# EAGLE design trezor_nuri (EAGLE 9.6.2)
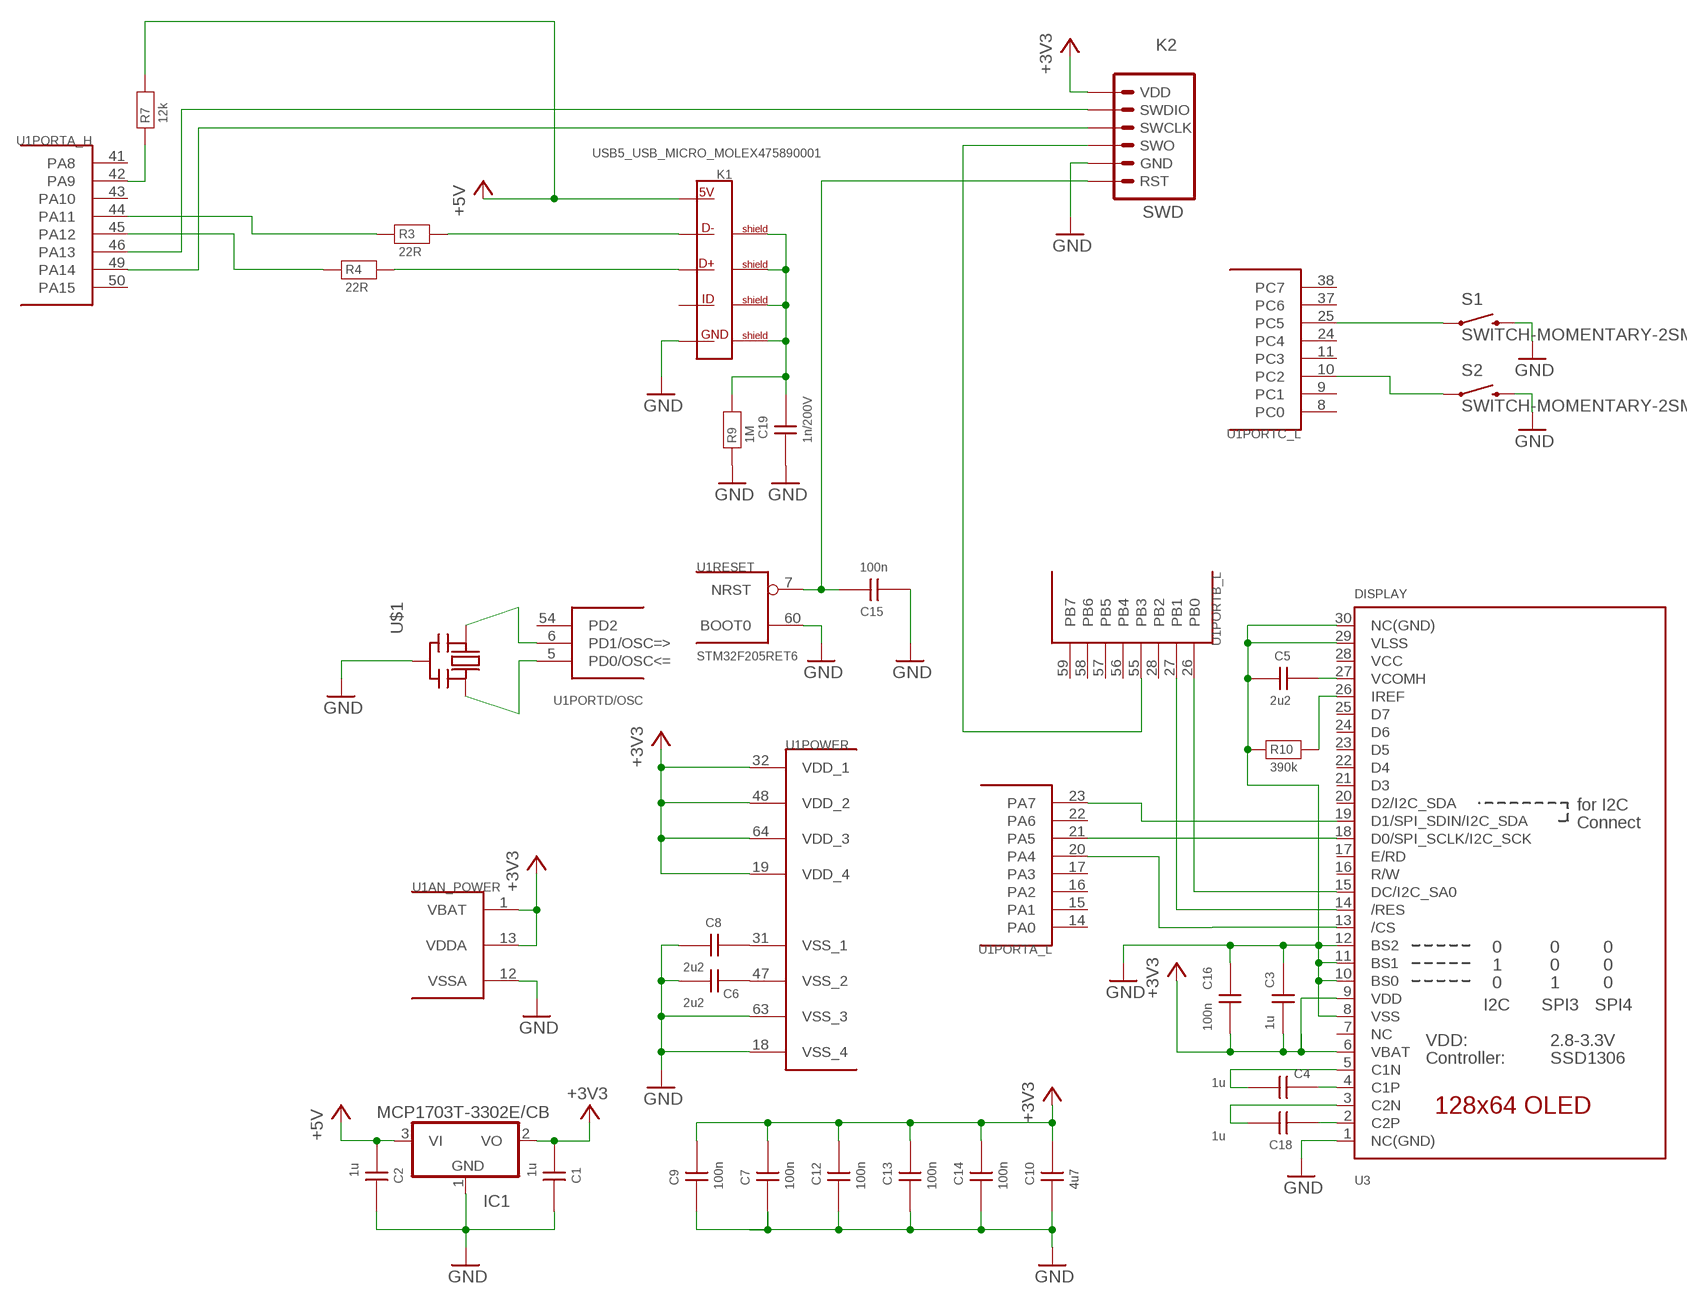
[diagram p0: schematic, sheet 1]

## Parts
C1  1u  C_0805  [0805]
C2  1u  C_0805  [0805]
C3  1u  C_0805  [0805]
C4  1u  C_0805  [0805]
C5  2u2  C_0805  [0805]
C6  2u2  C_0805  [0805]
C7  100n  C_0805  [0805]
C8  2u2  C_0805  [0805]
C9  100n  C_0805  [0805]
C10  4u7  C_0805  [0805]
C12  100n  C_0805  [0805]
C13  100n  C_0805  [0805]
C14  100n  C_0805  [0805]
C15  100n  C_0805  [0805]
C16  100n  C_0805  [0805]
C18  1u  C_0805  [0805]
C19  1n/200V  C_0805  [0805]
IC1  MCP1703T-3302E/CB  MCP1703CB  [SOT23]
K1  USB5_USB_MICRO_MOLEX475890001  [USB_MICRO-MOLEX475890001]
K2  SWD  [SWD]
R3  22R  R_0805  [0805]
R4  22R  R_0805  [0805]
R7  12k  R_0805  [0805]
R9  1M  R_0805  [0805]
R10  390k  R_0805  [0805]
S1  SWITCH-MOMENTARY-2SMD  [TACTILE_SWITCH_SMD]
S2  SWITCH-MOMENTARY-2SMD  [TACTILE_SWITCH_SMD]
U1  STM32F205RET6  STM32F10XRXT6  [TQFP64]
U3  DISPLAY  DISP_OLED_UG-2864HSWEG010.96"  [UG-2864HSWEG01_0.96IN_WRAPAROUND]
U$1  CERMOSCILL-CSTCRG  [CSTCR-G]

## Nets
+3V3: C1.1 C3.1 C7.2 C9.2 C10.2 C12.2 C13.2 C14.2 C16.1 IC1.2(VO) K2.6(VDD) U1.1(AN_POWER:VBAT) U1.13(AN_POWER:VDDA) U1.19(POWER:VDD_4) U1.32(POWER:VDD_1) U1.48(POWER:VDD_2) U1.64(POWER:VDD_3) U3.6(VBAT) U3.9(VDD)
+5V: C2.1 IC1.3(VI) K1.1(1_5V) R7.2
GND: C1.2 C2.2 C3.2 C5.1 C6.1 C7.1 C8.1 C9.1 C10.1 C12.1 C13.1 C14.1 C15.1 C16.2 C19.1 IC1.1(GND) K1.5(5_GND) K2.2(GND) R9.1 R10.1 S1.3 S1.4 S2.3 S2.4 U1.12(AN_POWER:VSSA) U1.18(POWER:VSS_4) U1.60(RESET:BOOT0) U1.63(POWER:VSS_3) U3.1(NC(GND)) U3.8(VSS) U3.10(BS0) U3.11(BS1) U3.12(BS2) U3.29(VLSS) U3.30(NC(GND)) U$1.2(GND)
N$1: U1.23(PORTA_L:PA7) U3.19(D1/SPI_SDIN/I2C_SDA)
N$2: C15.2 K2.1(RST) U1.7(RESET:NRST)
N$3: U1.26(PORTB_L:PB0) U3.15(DC/I2C_SA0)
N$4: C8.2 U1.31(POWER:VSS_1)
N$5: U1.21(PORTA_L:PA5) U3.18(D0/SPI_SCLK/I2C_SCK)
N$6: C5.2 U3.27(VCOMH)
N$7: U1.27(PORTB_L:PB1) U3.14(/RES)
N$8: C6.2 U1.47(POWER:VSS_2)
N$9: R10.2 U3.26(IREF)
N$10: C18.1 U3.2(C2P)
N$11: C4.1 U3.4(C1P)
N$12: C18.2 U3.3(C2N)
N$13: C4.2 U3.5(C1N)
N$14: K2.3(SWO) U1.55(PORTB_L:PB3)
N$15: K2.5(SWDIO) U1.46(PORTA_H:PA13)
N$16: U1.20(PORTA_L:PA4) U3.13(/CS)
N$17: K2.4(SWCLK) U1.49(PORTA_H:PA14)
N$18: R3.1 U1.44(PORTA_H:PA11)
N$19: S1.1 S1.2 U1.25(PORTC_L:PC5)
N$20: S2.1 S2.2 U1.10(PORTC_L:PC2)
N$23: K1.2(2_D-) R3.2
N$24: K1.3(3_D+) R4.2
N$26: C19.2 K1.S1_BOT(SHIELD_1) K1.S1_TOP(SHIELD_1) K1.S2_BOT(SHIELD_2) K1.S2_TOP(SHIELD_2) K1.S3_BOT(SHIELD_3) K1.S3_TOP(SHIELD_3) K1.S4_BOT(SHIELD_4) K1.S4_TOP(SHIELD_4) K1.SA(SHIELD_1) K1.SB(SHIELD_2) R9.2
N$27: R7.1 U1.42(PORTA_H:PA9)
USB_D_P: R4.1 U1.45(PORTA_H:PA12)
XTAL1: U1.6(PORTD/OSC:PD1/OSC=>) U$1.1(IN)
XTAL2: U1.5(PORTD/OSC:PD0/OSC<=) U$1.3(OUT)
Unconnected: K1.4(4_ID) U1.2(PORTC_H:PC13) U1.3(PORTC_H:PC14) U1.4(PORTC_H:PC15) U1.8(PORTC_L:PC0) U1.9(PORTC_L:PC1) U1.11(PORTC_L:PC3) U1.14(PORTA_L:PA0) U1.15(PORTA_L:PA1) U1.16(PORTA_L:PA2) U1.17(PORTA_L:PA3) U1.22(PORTA_L:PA6) U1.24(PORTC_L:PC4) U1.28(PORTB_L:PB2) U1.29(PORTB_H:PB10) U1.30(PORTB_H:PB11) U1.33(PORTB_H:PB12) U1.34(PORTB_H:PB13) U1.35(PORTB_H:PB14) U1.36(PORTB_H:PB15) U1.37(PORTC_L:PC6) U1.38(PORTC_L:PC7) U1.39(PORTC_H:PC8) U1.40(PORTC_H:PC9) U1.41(PORTA_H:PA8) U1.43(PORTA_H:PA10) U1.50(PORTA_H:PA15) U1.51(PORTC_H:PC10) U1.52(PORTC_H:PC11) U1.53(PORTC_H:PC12) U1.54(PORTD/OSC:PD2) U1.56(PORTB_L:PB4) U1.57(PORTB_L:PB5) U1.58(PORTB_L:PB6) U1.59(PORTB_L:PB7) U1.61(PORTB_H:PB8) U1.62(PORTB_H:PB9) U3.7(NC) U3.16(R/W) U3.17(E/RD) U3.20(D2/I2C_SDA) U3.21(D3) U3.22(D4) U3.23(D5) U3.24(D6) U3.25(D7)

## Power pins joined to a net without a drawn wire
VCC: U3.28(VCC)

## Library data of the parts
C1-C10 C12-C16 C18 C19 = vyber:C
IC1 = linear:MCP1703: 250 mA, 16V, Low Quiescent Current LDO Regulator Source: http://ww1.microchip.com/downloads/en/DeviceDoc/22049b.pdf
K1 = vyber:USB5
K2 = fabhack:SWD: SWD Miniature connector for ARM programming.
R3 R4 R7 R9 R10 = vyber:R
S1 S2 = SparkFun-Electromechanical:SWITCH-MOMENTARY-2: Various NO switches- pushbuttons, reed, etc
U1 = stm32:STM32F10XRXT6: STM32F101/103 64pin LQFP
U3 = microbuilder:DISP_OLED_UG-2864HSWEG01: UG-2864HSWEG01 OLED display Both 1.3" and 0.96" models share the same FPC tab footprint, only the screen dimensions vary.
U$1 = adafruit:CERMOSCILL: Ceramic oscillator with built in capacitors such as ZTT-12MHz http://www.ladyada.net/library/eagle

## Board
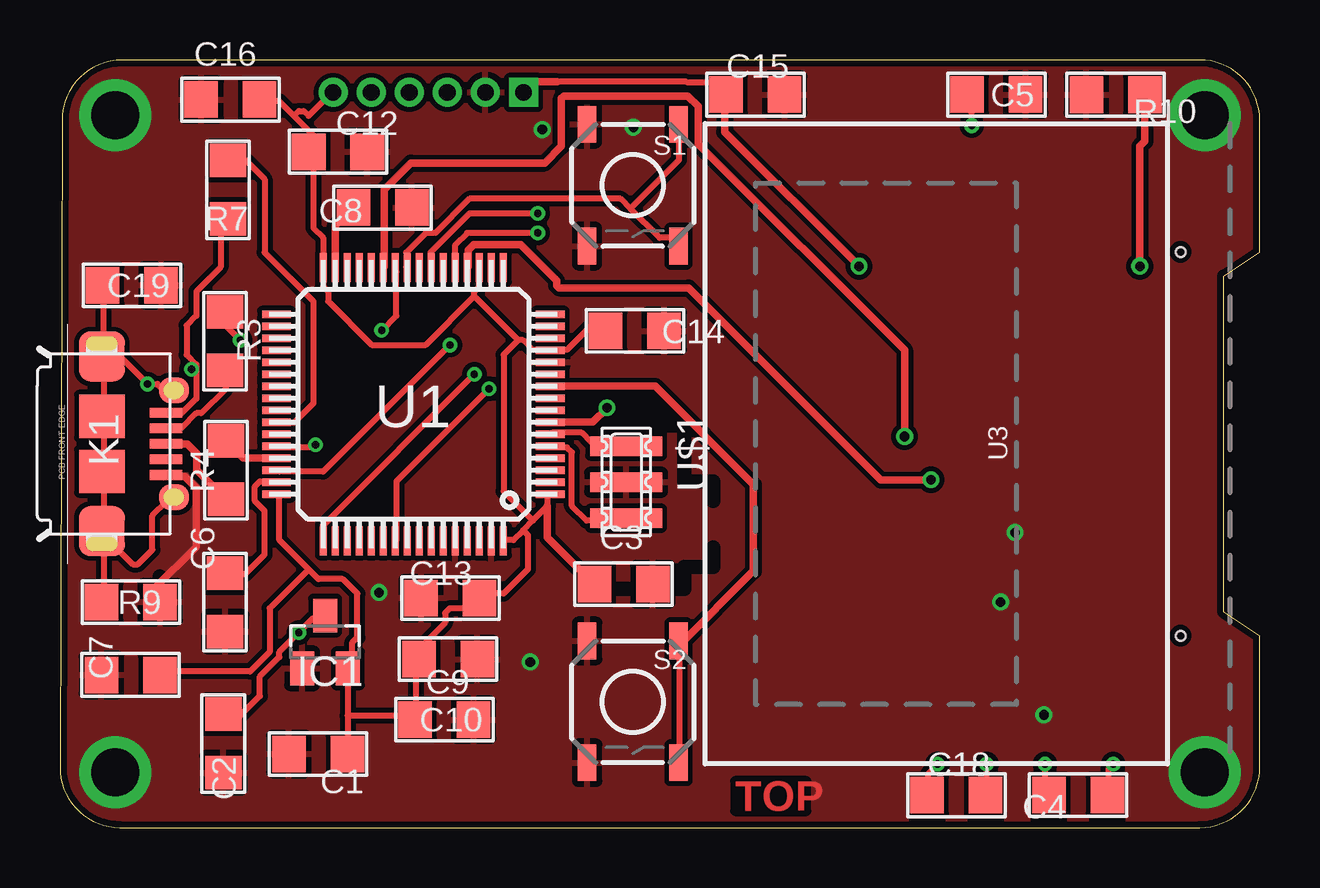
[diagram p1: board, top side]
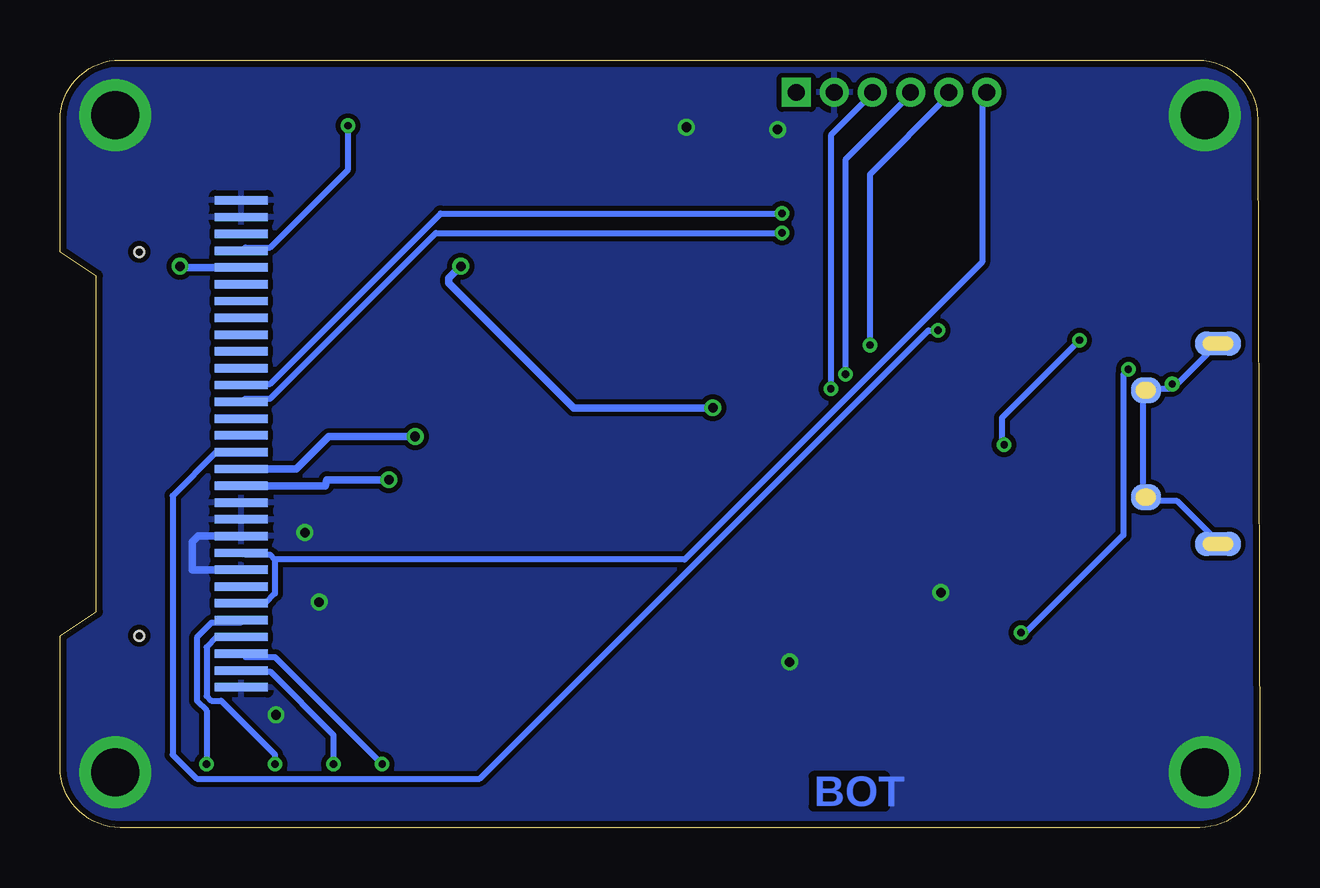
[diagram p2: board, bottom side, seen from below]

Size 49.99 x 32 mm. Coordinates in mm from the lower left corner, seen from the top.
Outline: 49.99,24 49.99,29.5 arc90 47.48,32 2.58,32 arc90 0.08,29.51 0,2.51 arc90 2.5,0 47.48,0 arc90 49.99,2.5 49.99,8 48.48,9 48.48,23 49.99,24
Copper layers (1*16): Top 0.035mm / dielectric 1.5mm / Bottom 0.035mm
Design rules "seeed-studio-2-layer": minimum track width 6mil, minimum drill 12mil, track to track 6mil, track to pad 6mil, pad to pad 6mil, via to via 6mil, smd to smd 0mil, copper to edge 10mil, drill to drill 10mil, minimum pad ring 10mil, minimum via ring 6mil, stop-mask expansion 2mil, vias tented up to drill 100mil, thermal gap 10mil
tRestrict: 11 lines
bRestrict: 5 lines

### Footprints (pad centres in the part's own frame; a part is rotated, then mirrored left to right if it is on the bottom)
0805 = smd 1.397 x 1.524: 1 -1.219,0; 2 1.219,0
SOT23 = smd 1 x 1.4: 1 -0.95,-1.1; 2 0.95,-1.1; 3 0,1.1
USB_MICRO-MOLEX475890001 = smd 1.35 x 0.4: 1 2.675,1.3; 2 2.675,0.65; 3 2.675,0; 4 2.675,-0.65; 5 2.675,-1.3 | smd 1.9 x 1 bottom: S1_BOT 0,4.175; S2_BOT 0,-4.175 | smd 1.9 x 2.075: S1_TOP 0,3.638; S2_TOP 0,-3.638 | smd 1.25 x 1.1 bottom: S3_BOT 3,-2.225; S4_BOT 3,2.225 | smd 1.25 x 1.1: S3_TOP 3,-2.225; S4_TOP 3,2.225 | smd 1.9 x 1.8: SA 0,-1.15; SB 0,1.15
SWD = drill 0.7 square: 1 0,0 | drill 0.7: 2 1.587,0; 3 3.175,0; 4 4.763,0; 5 6.35,0; 6 7.938,0
TACTILE_SWITCH_SMD = smd 1.524 x 0.762: 1 -2.54,1.905; 2 2.54,1.905; 3 -2.54,-1.905; 4 2.54,-1.905
TQFP64 = smd 1.2 x 0.3: 1 -5.7,3.75; 2 -5.7,3.25; 3 -5.7,2.75; 4 -5.7,2.25; 5 -5.7,1.75; 6 -5.7,1.25; 7 -5.7,0.75; 8 -5.7,0.25; 9 -5.7,-0.25; 10 -5.7,-0.75; 11 -5.7,-1.25; 12 -5.7,-1.75; 13 -5.7,-2.25; 14 -5.7,-2.75; 15 -5.7,-3.25; 16 -5.7,-3.75; 33 5.7,-3.75; 34 5.7,-3.25; 35 5.7,-2.75; 36 5.7,-2.25; 37 5.7,-1.75; 38 5.7,-1.25; 39 5.7,-0.75; 40 5.7,-0.25; 41 5.7,0.25; 42 5.7,0.75; 43 5.7,1.25; 44 5.7,1.75; 45 5.7,2.25; 46 5.7,2.75; 47 5.7,3.25; 48 5.7,3.75 | smd 0.3 x 1.2: 17 -3.75,-5.7; 18 -3.25,-5.7; 19 -2.75,-5.7; 20 -2.25,-5.7; 21 -1.75,-5.7; 22 -1.25,-5.7; 23 -0.75,-5.7; 24 -0.25,-5.7; 25 0.25,-5.7; 26 0.75,-5.7; 27 1.25,-5.7; 28 1.75,-5.7; 29 2.25,-5.7; 30 2.75,-5.7; 31 3.25,-5.7; 32 3.75,-5.7; 49 3.75,5.7; 50 3.25,5.7; 51 2.75,5.7; 52 2.25,5.7; 53 1.75,5.7; 54 1.25,5.7; 55 0.75,5.7; 56 0.25,5.7; 57 -0.25,5.7; 58 -0.75,5.7; 59 -1.25,5.7; 60 -1.75,5.7; 61 -2.25,5.7; 62 -2.75,5.7; 63 -3.25,5.7; 64 -3.75,5.7
UG-2864HSWEG01_0.96IN_WRAPAROUND = smd 0.35 x 2.2 bottom: 1 -10.15,-1.2; 2 -9.45,-1.2; 3 -8.75,-1.2; 4 -8.05,-1.2; 5 -7.35,-1.2; 6 -6.65,-1.2; 7 -5.95,-1.2; 8 -5.25,-1.2; 9 -4.55,-1.2; 10 -3.85,-1.2; 11 -3.15,-1.2; 12 -2.45,-1.2; 13 -1.75,-1.2; 14 -1.05,-1.2; 15 -0.35,-1.2; 16 0.35,-1.2; 17 1.05,-1.2; 18 1.75,-1.2; 19 2.45,-1.2; 20 3.15,-1.2; 21 3.85,-1.2; 22 4.55,-1.2; 23 5.25,-1.2; 24 5.95,-1.2; 25 6.65,-1.2; 26 7.35,-1.2; 27 8.05,-1.2; 28 8.75,-1.2; 29 9.45,-1.2; 30 10.15,-1.2 | hole 0.4: -8,-5.45; 8,-5.45
CSTCR-G = smd 0.8 x 3: 1 -1.5,0; 2 0,0; 3 1.5,0

### Placement (x,y rotation side)
C1  10.76,3.07 180 top
C2  6.8,3.5 270 top
C3  23.48,10.15 0 top
C4  42.42,1.35 0 top
C5  39.02,30.56 180 top
C6  6.88,9.39 90 top
C7  2.95,6.36 0 top
C8  13.44,25.85 180 top
C9  16.17,7.02 180 top
C10  16.02,4.5 180 top
C12  11.58,28.17 180 top
C13  16.27,9.57 0 top
C14  23.95,20.71 180 top
C15  28.98,30.56 180 top
C16  7.1,30.35 180 top
C18  37.35,1.35 180 top
C19  3,22.61 180 top
IC1  11.04,7.74 0 top
K1  1.74,16 0 top
K2  19.31,30.65 180 top
R3  6.88,20.28 270 top
R4  6.92,14.9 270 top
R7  7,26.59 270 top
R9  2.95,9.4 180 top
R10  43.98,30.55 0 top
S1  23.87,26.78 270 top
S2  23.87,5.24 270 top
U1  14.72,17.65 180 top
U3  41.24,16 90 top
U$1  23.59,14.4 270 top

### Tracks (layer width: path | path; a pad name or v marks a point on that pad's centre or on a via)
+3V3
  Top 0.254: 10.36,10.77 10.76,10.36 11.78,10.36 12.39,9.75 12.39,7.92 12.18,7.72 12.18,6.71 IC1.2 11.98,6.5 11.98,4.67 | 10.36,10.77 9.14,11.99 9.14,13.82 U1.48 | 10.36,10.77 8.73,9.14 8.73,7.32 7.92,6.5 4.26,6.5 C7.2 | 11.98,4.67 11.98,3.25 C1.1 | 11.98,4.67 14.62,4.67 C10.2 14.83,4.67 14.83,6.91 C9.2 15.03,7.11 15.03,7.52 16.05,8.53 16.05,8.94 16.25,9.14 17.06,9.14 17.47,9.55 C13.2 17.67,9.75 18.48,9.75 19.5,10.77 19.5,12.19 19.3,12.39 | 19.7,12.8 20.31,13.41 20.31,13.82 U1.1 | 19.7,12.8 19.3,12.39 | 19.3,12.39 18.89,11.99 18.48,11.99 U1.64 | C14.2 22.55,20.73 22.34,20.93 22.14,20.93 21.13,19.91 20.52,19.91 U1.13 20.31,19.91 19.7,19.91 19.3,20.32 19.09,20.32 | 17.26,22.15 17.26,22.35 17.47,22.55 17.47,23.16 U1.19 | 19.09,20.32 17.26,22.15 | 19.7,12.8 18.49,14.02 18.49,19.71 19.09,20.32 | 9.75,29.67 10.56,28.85 10.56,28.25 C12.2 10.56,28.04 10.56,24.99 10.97,24.59 10.97,23.37 U1.32 10.97,23.16 10.97,22.55 11.17,22.35 11.17,21.95 13,20.12 15.23,20.12 17.26,22.15 | 9.75,29.67 9.14,30.28 8.32,30.28 C16.1 | 9.75,29.67 9.95,29.87 10.15,29.87 10.36,29.67 11.17,30.48 11.37,30.48 K2.6
  Top 0.305: C3.1 20.31,12.1 20.31,13.41
  Bottom 0.254: 41.04,11.18 41.04,9.75 41.45,9.35 42.26,9.35 U3.6 | 41.04,11.18 41.24,11.38 42.26,11.38 U3.9 | 41.04,11.18 23.97,11.18 11.57,23.57 11.57,30.48 K2.6
+5V  (via drill 0.3)
  Top 0.254: IC1.3 10.97,8.74 10.56,8.74 v9.95,8.13 9.14,7.32 9.14,7.11 8.32,6.3 8.32,5.49 7.51,4.67 6.9,4.67 C2.1 | 5.68,19.1 5.68,19.3 5.28,19.71 5.28,20.93 5.68,21.34 5.68,22.35 6.7,23.37 6.7,24.99 6.9,25.2 R7.2 | 5.68,19.1 5.68,17.88 5.07,17.27 4.46,17.27 K1.1 | 5.68,19.1 v5.48,19.1
  Bottom 0.254: v9.95,8.13 9.75,8.13 5.68,12.19 5.68,18.9 v5.48,19.1
GND  (via drill 0.4, 2)
  Top 0.305: K1.5 4.49,14.63 5.21,14.63 5.67,14.16 5.67,11.7 3.91,9.94
  Bottom 0.305: U3.10 44.24,12.15 44.49,11.9 44.49,10.75 U3.8
  other vias: 19.59,6.9 13.29,9.8 40.99,4.7 39.79,12.3 20.09,29.1 23.89,29.2 39.19,9.4 2.29,2.3 2.29,29.7 47.69,29.7 47.69,2.3
  pour Top (isolate 0.203): -0.01,-3.21 53.18,-3.21 53.18,32.92 -0.01,32.92
  pour Bottom (isolate 0.203): -0.01,-4.73 55.28,-4.73 55.28,34.13 -0.01,34.13
N$1  (via drill 0.3)
  Top 0.254: v19.91,25.6 17.06,25.6 15.44,23.98 15.44,23.37 U1.23
  Bottom 0.254: v19.91,25.6 34.13,25.6 41.24,18.49 42.26,18.49 U3.19
N$2  (via drill 0.4)
  Top 0.254: 20.72,31.09 26.11,31.09 26.11,31.08 27.22,31.08 C15.2
  Top 0.305: 20.72,31.09 19.76,31.09 K2.1 | U1.7 22.19,16.9 v22.79,17.5 | C15.2 27.69,30.49 27.69,29 v33.29,23.4
  Bottom 0.305: v22.79,17.5 28.59,17.5 33.79,22.7 33.79,22.9 v33.29,23.4
N$3  (via drill 0.3)
  Top 0.254: v13.4,20.73 14.01,21.34 14.01,23.16 U1.26
  Bottom 0.254: v13.4,20.73 13.81,20.73 32.5,2.03 44.29,2.03 45.3,3.04 45.3,13.83 43.48,15.65 42.46,15.65 U3.15
N$4
  Top 0.305: U1.31 11.47,25.1 C8.2
N$5  (via drill 0.3)
  Top 0.254: v19.91,24.79 16.96,24.79 16.45,24.28 16.45,23.37 U1.21
  Bottom 0.254: v19.91,24.79 34.33,24.79 41.24,17.88 42.26,17.88 U3.18
N$6  (via drill 0.3)
  Top 0.254: v37.99,29.26 37.99,30.48 C5.2
  Bottom 0.254: v37.99,29.26 37.99,27.43 41.24,24.18 42.26,24.18 U3.27
N$7  (via drill 0.4)
  Top 0.305: U1.27 13.51,23.39 13.51,26.59 14.62,27.7 20.19,27.7 20.89,28.4 20.89,30.4 20.99,30.5 26.17,30.5 26.59,30.07 26.59,28.5 35.19,19.9 v35.19,16.3
  Bottom 0.305: U3.14 40.14,14.95 38.79,16.3 v35.19,16.3
N$8
  Top 0.254: U1.47 8.93,14.43 8.32,14.43 8.12,14.22 8.12,13.61 8.53,13.21 8.53,11.38 7.71,10.57 6.9,10.57 C6.2
N$9  (via drill 0.4)
  Top 0.305: R10.2 45.2,28.61 44.99,28.4 v44.99,23.4
  Bottom 0.305: U3.26 44.94,23.35 v44.99,23.4
N$10  (via drill 0.3)
  Top 0.254: v38.6,2.64 38.6,1.42 C18.1
  Bottom 0.254: v38.6,2.64 38.6,3.86 41.24,6.5 42.26,6.5 U3.2
N$11  (via drill 0.3)
  Top 0.254: v41.04,2.64 41.04,1.42 C4.1
  Bottom 0.254: v41.04,2.64 41.04,3.05 43.27,5.28 43.68,5.28 43.88,5.49 43.88,7.52 43.48,7.92 42.46,7.92 U3.4
N$12  (via drill 0.3)
  Top 0.254: v36.57,2.64 36.16,2.23 36.16,1.42 C18.2
  Bottom 0.254: v36.57,2.64 41.04,7.11 42.26,7.11 U3.3
N$13  (via drill 0.3)
  Top 0.254: v43.88,2.64 43.68,2.44 43.68,1.42 C4.2
  Bottom 0.254: v43.88,2.64 43.88,4.88 44.29,5.28 44.29,7.92 43.68,8.53 42.46,8.53 U3.5
N$14  (via drill 0.3)
  Top 0.254: v17.87,18.29 14.01,14.43 14.01,11.99 U1.55
  Bottom 0.254: v17.87,18.29 17.87,28.85 16.25,30.48 K2.3
N$15  (via drill 0.3)
  Top 0.254: v16.25,20.12 10.97,14.83 9.14,14.83 U1.46
  Bottom 0.254: v16.25,20.12 16.25,27.23 13,30.48 K2.5
N$16  (via drill 0.4)
  Top 0.305: U1.20 17.02,23.39 17.02,24.07 17.25,24.3 19.19,24.3 20.69,22.8 20.69,22.6 20.79,22.5 26.19,22.5 34.2,14.49 34.21,14.5 v36.29,14.5
  Bottom 0.305: U3.13 38.93,14.25 38.87,14.5 v36.29,14.5
N$17  (via drill 0.3)
  Top 0.254: v17.26,18.9 10.97,12.6 10.97,11.99 U1.49
  Bottom 0.254: v17.26,18.9 17.26,27.84 14.62,30.48 K2.4
N$18  (via drill 0.3)
  Top 0.254: v10.65,15.96 10.55,15.85 9.14,15.85 U1.44 | v7.51,20.32 6.9,20.93 6.9,21.34 R3.1
  Bottom 0.254: v10.65,15.96 10.75,16.06 10.75,17.08 v7.51,20.32
N$19
  Top 0.254: 23.77,25.81 24.99,24.59 25.6,24.59 25.8,24.38 S1.2 | 23.77,25.81 23.36,26.21 17.06,26.21 15.64,24.79 15.23,24.79 14.42,23.98 14.42,23.37 U1.25 | 23.77,25.81 25.8,27.84 25.8,29.26 S1.1
N$20
  Top 0.254: S2.2 25.8,2.85 25.8,7.6 25.8,7.72 S2.1
  Top 0.305: U1.10 24.8,18.4 28.89,14.3 28.89,10.69 25.8,7.6
N$23
  Top 0.254: K1.2 4.46,16.66 5.07,16.66 5.68,17.27 5.89,17.27 6.9,18.29 6.9,18.9 R3.2
N$24
  Top 0.305: K1.3 5.29,16 5.69,15.6 5.69,14.91 R4.2
N$26  (via drill 0.3)
  Top 0.254: 2.23,11.79 1.82,12.19 K1.S2_TOP | 2.23,11.79 3.04,10.97 3.24,10.97 3.85,11.58 3.85,13.01 4.46,13.61 4.67,13.61 K1.S3_TOP | 2.23,11.79 1.82,11.38 1.82,9.55 R9.2 | 2.23,11.79 K1.S2_TOP | 1.82,19.51 2.63,19.51 v3.65,18.49 4.06,18.49 4.26,18.29 4.67,18.29 K1.S4_TOP | C19.2 1.82,22.55 1.82,19.71 K1.S1_TOP 1.82,19.51 | 1.82,19.51 1.82,17.27 K1.SB 1.82,17.07 1.82,15.04 K1.SA 1.82,14.83 1.82,12.39 K1.S2_TOP
  Bottom 0.254: K1.S2_BOT 1.82,11.99 3.45,13.61 4.67,13.61 K1.S3_TOP 4.87,13.82 4.87,18.09 K1.S4_TOP 4.67,18.29 3.65,18.29 | 3.65,18.29 1.82,20.12 K1.S1_BOT | v3.65,18.49 3.65,18.29
N$27
  Top 0.254: U1.42 9.14,16.87 9.75,16.87 10.56,17.68 10.56,21.95 8.53,23.98 8.53,27.03 7.71,27.84 7.1,27.84 R7.1
USB_D_P
  Top 0.305: U1.45 7.64,15.4 R4.1
XTAL1
  Top 0.254: U1.6 20.52,16.46 21.73,16.46 22.14,16.05 23.56,16.05 U$1.1
XTAL2
  Top 0.254: U1.5 20.52,15.85 21.13,15.85 21.33,15.65 21.33,13.41 21.94,12.8 23.56,12.8 U$1.3

### Text on the board
Top: TOP
Bottom: BOT
Measures: 5.92 mm | 10.06 mm | 10.77 mm | 4.80 mm | 5.33 mm | 0.00 mm | 0.20 mm | 4.42 mm | 6.48 mm | 14.22 mm | 48.49 mm | 49.99 mm | 14.61 mm | 26.64 mm | 26.70 mm | 23.14 mm | 25.20 mm | 20.65 mm | 22.23 mm | 18.39 mm | 17.86 mm | 18.36 mm | 17.09 mm | 9.60 mm | 8.36 mm | 8.86 mm | 8.33 mm | 4.34 mm | 6.07 mm | 1.52 mm | 2.29 mm | 0.00 mm | 0.00 mm | 0.00 mm | 4.17 mm | 15.01 mm | 6.22 mm | 48.54 mm | 49.81 mm | 10.31 mm | 11.02 mm | 0.74 mm | 4.55 mm | 5.08 mm | 5.66 mm
Drill_legend: Vrtaci plan | Vytvoreno : 14.5.2014 6:51:55 | 0.7000 mm / 27.559 mil | 0.4000 mm / 15.748 mil